# EasyEDA schematic Motor PI Hat.json
TITLE: Motor Car PI Hat; REV: 1.0; Date: 2021-05-08; Sheet: 1/1; Drawn By: Mitchell Day; Company: Mitchell Day
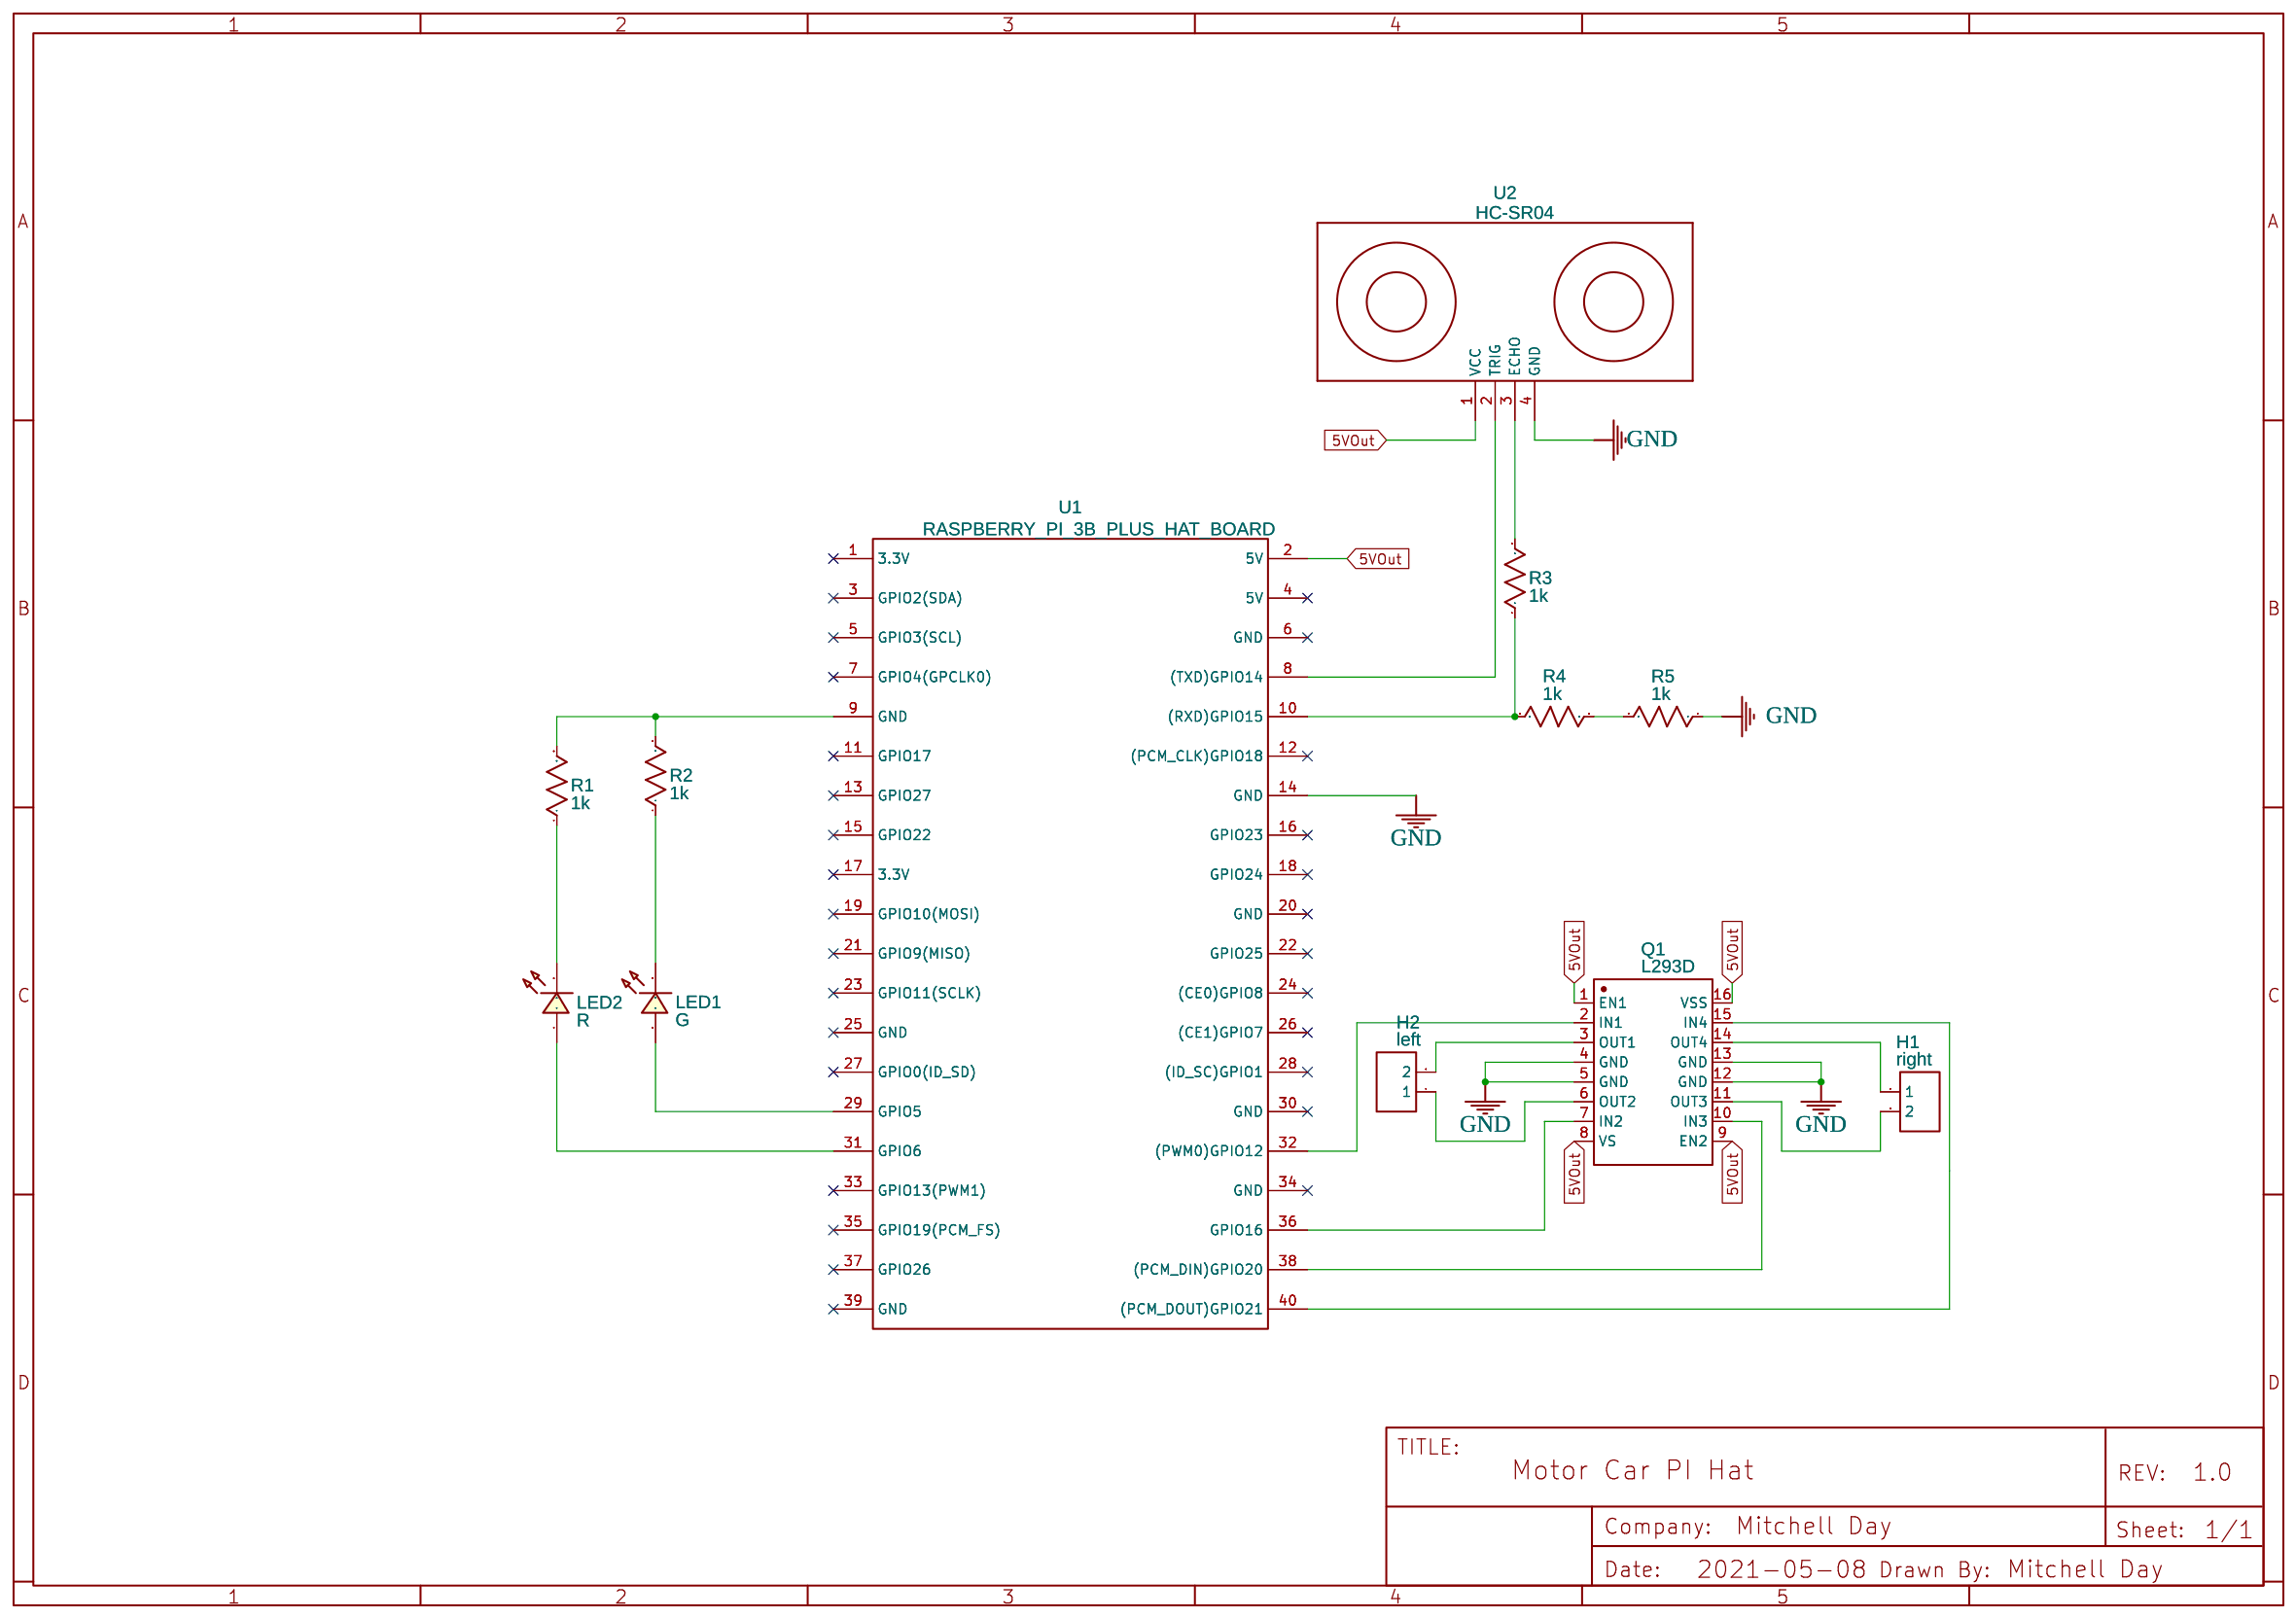
[diagram p0: schematic sheet]

## Parts
H1  right  [HDR-F-2.54_1X2]
H2  left  [HDR-F-2.54_1X2]
LED1  G  [LED-TH_BD3.0_GREEN]
LED2  R  [LED-TH_BD3.0_RED]
Q1  L293D  [DIP-16]
R1  1k  [R_AXIAL-0.3]
R2  1k  [R_AXIAL-0.3]
R3  1k  [R_AXIAL-0.3]
R4  1k  [R_AXIAL-0.3]
R5  1k  [R_AXIAL-0.3]
U1  RASPBERRY_PI_3B_PLUS_HAT_BOARD  [RASPBERRY_PI_3B_PLUS_HAT_BOARD]
U2  HC-SR04  [HC-SR04]

## Library data of the parts
H1 H2 = HDR-F-2.54_1x2: Supplier Part: C49661; Supplier: LCSC; Contributor: LCEDA_Lib
LED1 = LED-TH-3mm_G: Manufacturer: EVERLIGHT(台湾亿光); Manufacturer Part: 204-10SYGD/S530-E3; Supplier Part: C85161; Contributor: LCEDA_Lib
LED2 = LED-TH-3mm_R: Manufacturer: EVERLIGHT(台湾亿光); Manufacturer Part: 204-10SDRD/S530-A3-L; Supplier Part: C84774; Supplier: LCSC; Contributor: LCEDA_Lib
Q1 = L293D: Supplier: LCSC; Manufacturer: MIXIC; Manufacturer Part: POWERDIP16; Supplier Part: SGS-THOMSON; Contributor: Sebastian Esquivel
R1-R5 = R_AXIAL-0.3_US: Contributor: LCEDA_Lib
U1 = RASPBERRY_PI_3B_PLUS_HAT_BOARD: catid: 20; Contributor: lwweb; Manufacturer Part: Raspberry-Pi-3B-Plus-HAT-Board
U2 = HC-SR04: Ultrasonic Ranging Module HC-SR04; Contributor: h6000p

## Nets
5VOut: Q1.1(EN1) Q1.8(VS) Q1.9(EN2) Q1.16(VSS) U1.2(5V) U2.1(VCC)
GND: Q1.4(GND) Q1.5(GND) Q1.12(GND) Q1.13(GND) R5.1 U1.14(GND) U2.4(GND)
Net-(H1-1): H1.1 Q1.14(OUT4)
Net-(H1-2): H1.2 Q1.11(OUT3)
Net-(H2-1): H2.1 Q1.6(OUT2)
Net-(H2-2): H2.2 Q1.3(OUT1)
Net-(LED1-1): LED1.1 U1.29(GPIO5)
Net-(LED1-2): LED1.2 R2.1
Net-(LED2-1): LED2.1 U1.31(GPIO6)
Net-(LED2-2): LED2.2 R1.1
Net-(Q1-2): Q1.2(IN1) U1.32((PWM0)GPIO12)
Net-(Q1-7): Q1.7(IN2) U1.36(GPIO16)
Net-(Q1-10): Q1.10(IN3) U1.38((PCM_DIN)GPIO20)
Net-(Q1-15): Q1.15(IN4) U1.40((PCM_DOUT)GPIO21)
Net-(R1-2): R1.2 R2.2 U1.9(GND)
Net-(R3-1): R3.1 R4.2 U1.10((RXD)GPIO15)
Net-(R3-2): R3.2 U2.3(ECHO)
Net-(R4-1): R4.1 R5.2
Net-(U1-8): U1.8((TXD)GPIO14) U2.2(TRIG)

Not connected (* = marked no-connect by the designer): U1 1(3.3V)* 3(GPIO2(SDA))* 4(5V)* 5(GPIO3(SCL))* 6(GND)* 7(GPIO4(GPCLK0))* 11(GPIO17)* 12((PCM_CLK)GPIO18)* 13(GPIO27)* 15(GPIO22)* 16(GPIO23)* 17(3.3V)* 18(GPIO24)* 19(GPIO10(MOSI))* 20(GND)* 21(GPIO9(MISO))* 22(GPIO25)* 23(GPIO11(SCLK))* 24((CE0)GPIO8)* 25(GND)* 26((CE1)GPIO7)* 27(GPIO0(ID_SD))* 28((ID_SC)GPIO1)* 30(GND)* 33(GPIO13(PWM1))* 34(GND)* 35(GPIO19(PCM_FS))* 37(GPIO26)* 39(GND)*
